# Altium schematic sheet GPS.SchDoc
size Letter
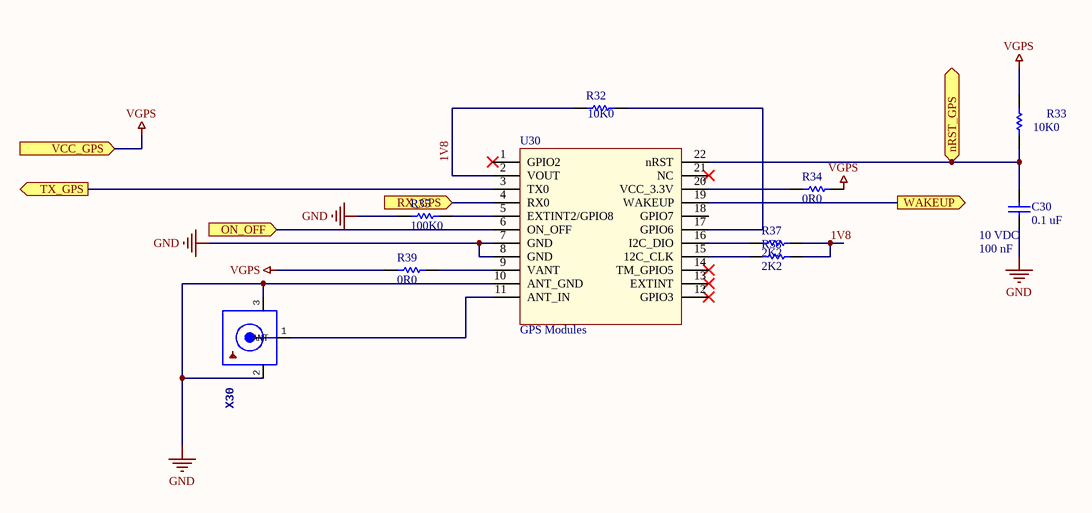
[diagram p0: GPS.SchDoc]

## Parts
C30  Capacitance: 0.1 uF  Voltage Rating DC: 10 VDC  Capacitance - nF: 100 nF  [C0402]  (hidden comment: 100 nF, 10 V)
R32  value 10K0  [0402_RES]  (hidden comment: CRCW040210K0FKTD)
R33  value 10K0  [0402_RES]  (hidden comment: CRCW040210K0FKTD)
R34  PANASONIC ELECTRONIC COMPONENTS  [0402_RES]  (value not drawn)
R35  Resistance: 100K0  [0402_RES]  (hidden comment: CRCW0402100KFKED)
R37  ERJ-2RKF2201X  [0402_RES]  (value not drawn)
R38  ERJ-2RKF2201X  [0402_RES]  (value not drawn)
R39  PANASONIC ELECTRONIC COMPONENTS  [0402_RES]  (value not drawn)
U30  Product Type: GPS Modules  [GPS]  (hidden comment: 927-A2200-A)
X30  RECE.20279.001E.01  [U.FL]  (value not drawn)

## Ports
nRST_GPS (in), ON_OFF (in), RX_GPS (in), TX_GPS (out), VCC_GPS (in), WAKEUP (out)

## Nets
GND: C30.2 R35.1 U30.7(GND) U30.8(GND) U30.10(ANT_GND) X30.2(GND) X30.3(GND)
VGPS: R33.2 R34.2 R39.1 ; port VCC_GPS
1V8: R32.1 R37.2 R38.2 U30.2(VOUT)
nRST_GPS: C30.1 R33.1 U30.22(nRST) ; port nRST_GPS
ON_OFF: U30.6(ON_OFF) ; port ON_OFF
RX_GPS: U30.4(RX0) ; port RX_GPS
TX_GPS: U30.3(TX0) ; port TX_GPS
WAKEUP: U30.19(WAKEUP) ; port WAKEUP
NetR32_2: R32.2 U30.17(GPIO6)
NetR34_1: R34.1 U30.20(VCC_3.3V)
NetR35_2: R35.2 U30.5(EXTINT2/GPIO8)
NetR37_1: R37.1 U30.16(I2C_DIO)
NetR38_1: R38.1 U30.15(12C_CLK)
NetR39_2: R39.2 U30.9(VANT)
NetU30_11: U30.11(ANT_IN) X30.1(ANT)

Not connected (* = marked no-connect by the designer): U30 1(GPIO2)* 12(GPIO3)* 13(EXTINT)* 14(TM_GPIO5)* 18(GPIO7) 21(NC)*

## Notes on the sheet
- Proyecto:
- CENTRO DE INGENIERIA Y DESARROLLO INDUSTRIAL
- Titulo:
- Fecha:
- Hoja:
- Elaborado por:
- de
- Hora:
- Revisión:
- Revisado por:
- CIDESI_template_letter

## Library data of the parts
C30 = 100 nF, 10 V: Multilayer Ceramic Capacitors MLCC - SMD/SMT 0402 0.1uF 10volts X7R 10%; Manufacturer: Murata Electronics; Manufacturer Part Number: GRM155R71A104KA01D; Type: General Purpose MLCC; Capacitance - pF: 100000 pF; Qualification: Commercial; Supplier 1: Mouser; RoHS: RoHS Compliant; Stock 1: 259611; Pricing 1: 1=0.100, 10=0.006, 100=0.004, 500=0.003, 10000=0.003 (USD); Packaging: Reel; ComponentLink1URL: http://www.mouser.com/ds/2/281/c02e-2905.pdf; ComponentLink1Description: http://www.mouser.com/ds/2/281/c02e-2905.pdf; Supplier Part Number 1: 81-GRM155R71A104KA1D; Category: Multilayer Ceramic Capacitors MLCC - SMD/SMT; Height: 0.5 mm; Length: 1 mm; Package / Case: 0402 (1005 metric); Product: General Type MLCCs; Series: GRM; Termination Style: SMD/SMT; Tolerance: 10 %; Width: 0.5 mm; Brand: Murata Electronics; Case Code - in: 0402; Case Code - mm: 1005; Dielectric: X7R; Maximum Operating Temperature: + 125 C; Minimum Operating Temperature: - 55 C; Standard Pack Qty: 10000; RoHS - Mouser: Y; Minimum Order Quantity: 1; Reeling: True
R32 R33 = 10 KOHM, 63 mW: Resistor; Manufacturer 1: VISHAY DALE; Supplier 1: Newark; Manufacturer Part Number: CRCW040210K0FKTD; RoHS: NO; Stock 1: 12163; Pricing 1: 1=0.073, 10=0.039, 100=0.023, 1000=0.019 (USD); ComponentLink1URL: http://www.farnell.com/datasheets/1914725.pdf; ComponentLink1Description: http://www.farnell.com/datasheets/1914725.pdf; Supplier Part Number 1: 96C9543
R34 R39 = 0R0: Resistor; Manufacturer Part Number: ERJ-2GE0R00X; Product Range: ERJ2; Voltage Rating: 50; Resistor Case Style: 0402 [1005 Metric]; Power Rating: 100; Resistor Element Type: Thick Film; Supplier 1: Newark; Manufacturer: PANASONIC ELECTRONIC COMPONENTS; RoHS: YES; Stock 1: 130000; Pricing 1: 1=0.006, 10000=0.006 (USD); Resistance Tolerance: -; ComponentLink1URL: http://www.farnell.com/datasheets/2059623.pdf; ComponentLink1Description: http://www.farnell.com/datasheets/2059623.pdf; Supplier Part Number 1: 97W7189; Resistance: 0R0
R35 = 100K0,63mW: Resistor; Manufacturer: VISHAY; Supplier 1: Newark; Manufacturer Part Number: CRCW0402100KFKED; RoHS: YESX; Stock 1: 84915; Pricing 1: 1=0.131, 10=0.055, 25=0.05, 50=0.043, 100=0.038, 250=0.033, 500=0.026, 1000=0.021 (USD); ComponentLink1URL: http://www.farnell.com/cad/1551208.zip; ComponentLink1Description: http://www.farnell.com/cad/1551208.zip; ComponentLink2URL: http://www.farnell.com/datasheets/2310790.pdf; ComponentLink2Description: http://www.farnell.com/datasheets/2310790.pdf; Supplier Part Number 1: 61M5269
R37 R38 = 2K2: Resistor; Manufacturer: PANASONIC; Resistor Case Style: 0402 [1005 Metric]; Product Range: ERJ2; Voltage Rating: 50; Resistor Element Type: Thick Film; Power Rating: 100; Resistance Tolerance: ± 1%; Supplier 1: Newark; Manufacturer Part Number: ERJ-2RKF2201X; RoHS: YES; Stock 1: 10000; Pricing 1: 1=0.294, 25=0.044, 100=0.026, 250=0.024, 500=0.02, 1000=0.017, 2500=0.016, 5000=0.013 (USD); ComponentLink1URL: http://www.farnell.com/cad/1560012.zip; ComponentLink1Description: http://www.farnell.com/cad/1560012.zip; ComponentLink2URL: http://www.farnell.com/datasheets/1911175.pdf; ComponentLink2Description: http://www.farnell.com/datasheets/1911175.pdf; Supplier Part Number 1: 64R5268; Resistance: 2K2
U30 = GPS: Manufacturer: Maestro Wireless Solutions; Frequency: 1.575 GHz; Interface Type: UART, SPI; Number of Channels: 48 Channel; Acquisition Sensitivity: - 163 dBm; Horizontal Position Accuracy: 2.5 m; Operating Supply Current: 41 mA; Operating Supply Voltage: 3.3 V; Time To First Fix - Cold Start: 35 s; Supplier 1: Mouser; Manufacturer Part Number: A2200-A; RoHS: RoHS Compliant; Category: GPS Modules; Stock 1: 1186; Pricing 1: 1=21.31, 5=20.29, 10=19.37, 25=17.91, 50=17.42, 100=16.94, 250=15.50, 500=14.52, 1300=12.00 (MXN); Dimensions: 14 mm x 10.2 mm x 2.5 mm; Packaging: Cut Tape; Brand: Maestro Wireless Solutions; Mounting Style: SMD/SMT; Maximum Operating Temperature: + 85 C; Standard Pack Qty: 1300; Subcategory: Wireless & RF Modules; RoHS - Mouser: Y; Minimum Order Quantity: 1; Reeling: True; ComponentLink1URL: http://www.mouser.com/datasheet/2/251/Maestro_A2200_GPS_Module_Product_Brief_v14-2-1109224.pdf; ComponentLink1Description: http://www.mouser.com/datasheet/2/251/Maestro_A2200_GPS_Module_Product_Brief_v14-2-1109224.pdf; Supplier Part Number 1: 927-A2200-A
X30 = SMACONNECTOR_UFL: Connector UFL; Manufacturer: Taoglas; Supplier 1: Mouser; Manufacturer Part Number: RECE.20279.001E.01; RoHS: RoHS Compliant; Category: RF Connectors / Coaxial Connectors; Stock 1: 0; Brand: Taoglas; Product Type: RF Connectors / Coaxial Connectors; Subcategory: RF Interconnects; Minimum Order Quantity: 1; Reeling: False; Supplier Part Number 1: N/A